# EasyEDA Pro project 舞台灯散热器适配(90W_灯珠驱动一体).epro

# Schematic 100W带驱动

## Sheets
1 P1: Board Name: KonkaH7Pro-90W灯板; Create Date: 2025-04-17; Page Name: P1; Project Name: 舞台灯散热器适配; Schematic Name: KonkaH7Pro; Update Date: 2025-04-17; Company: 嘉立创EDA; Page Size: A4; Version: V1.0
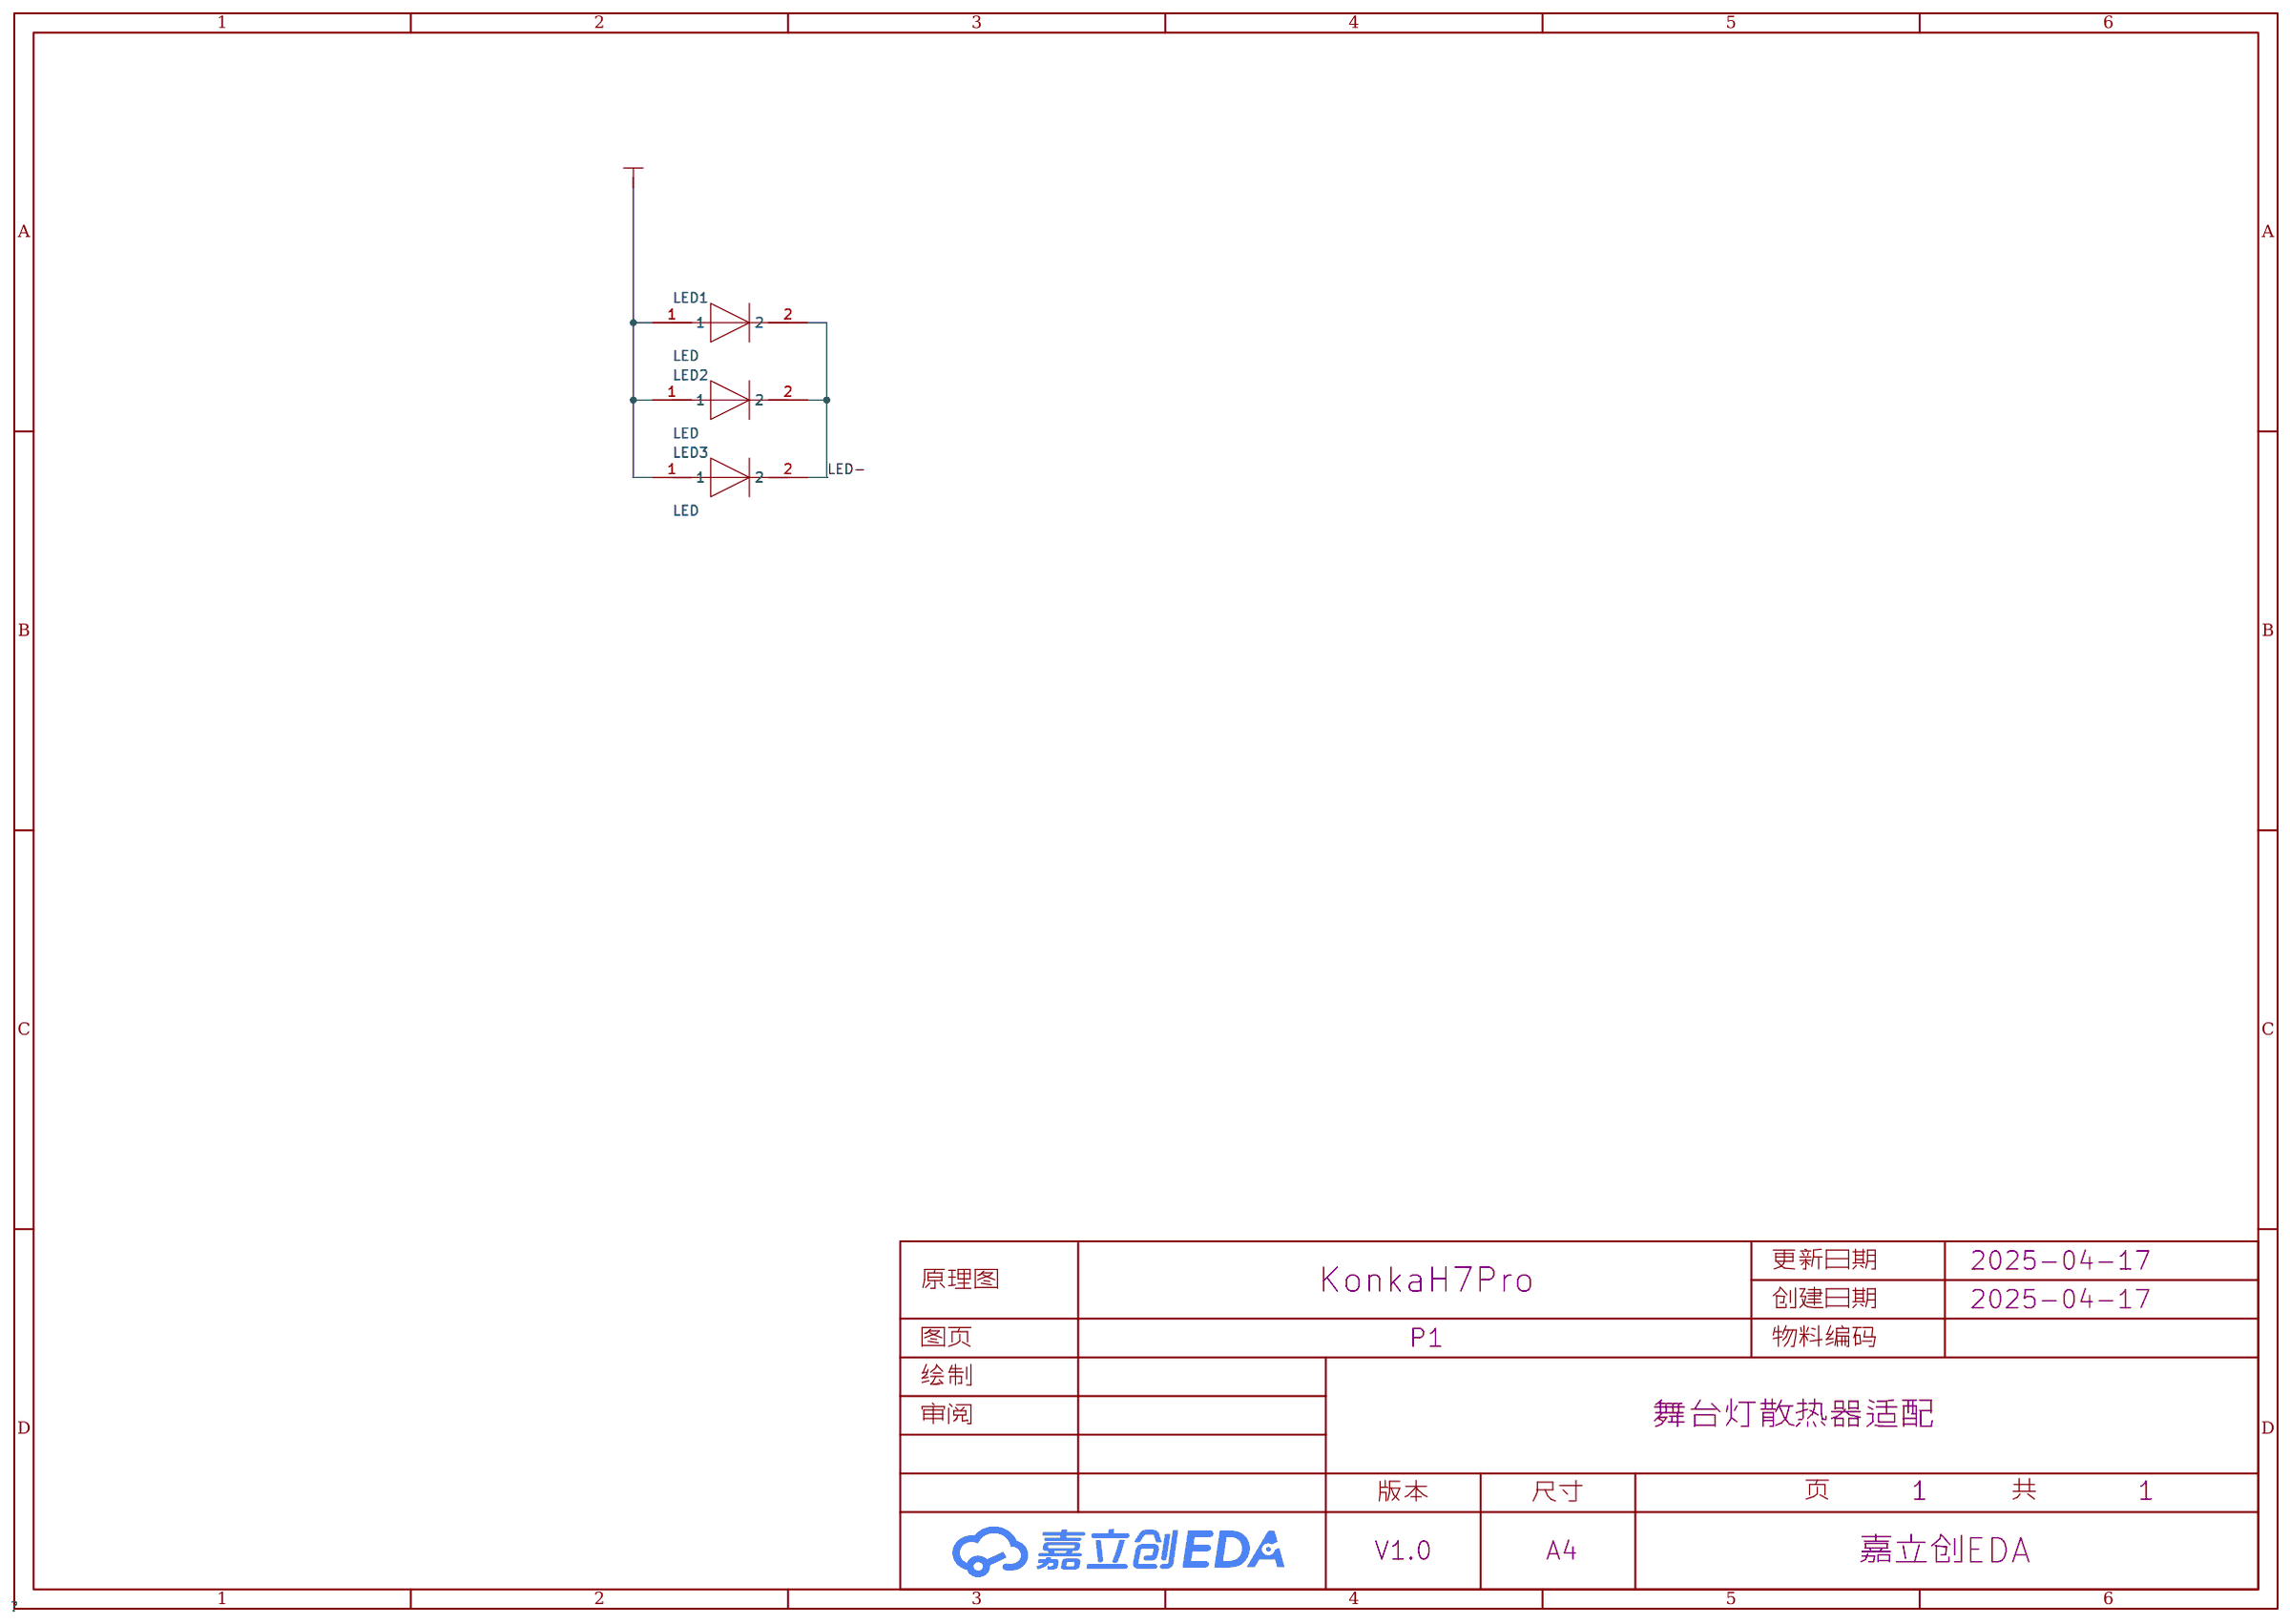
[diagram p0: P1]
2 P2: Board Name: 100W带驱动; Page Name: P2; Schematic Name: 100W带驱动
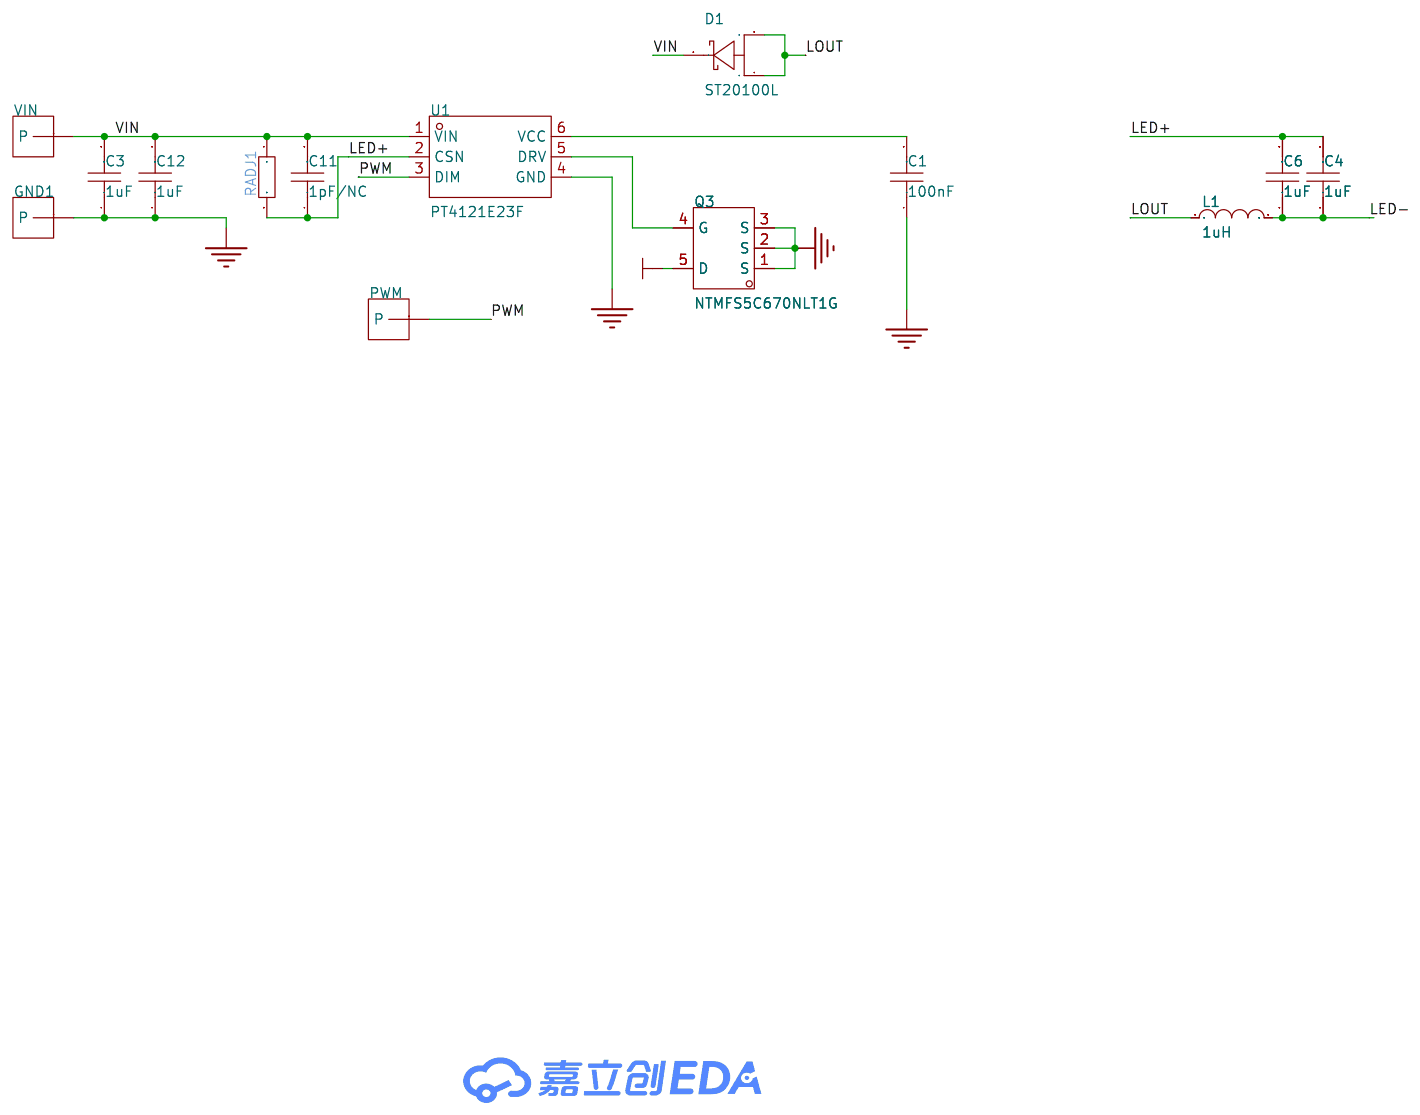
[diagram p1: P2]

## Parts
sheet P1
LED1  LED  [固仕泰3570LED-30W]
LED2  LED  [固仕泰3570LED-30W]
LED3  LED  [固仕泰3570LED-30W]
sheet P2
C1  100nF  [R0603]
C3  1uF  [C0805]
C4  1uF  [C0805]
C6  1uF  [C0805]
C11  1pF/NC  [R0603]
C12  1uF  [C0805]
D1  ST20100L  [TO-277_3P-L5.7-W4.2-LS6.5-BR]
GND1  -  [焊盘1.6*2.2mm]  (no BOM)
L1  1uH  [IND-SMD_L7.0-W6.6]
PWM  -  [焊盘1.6*2.2mm]  (no BOM)
Q3  NTMFS5C670NLT1G  [DFN-5_L6.1-W5.1-P1.27-BL]
RADJ1  20mΩ  [RES-SMD_L6.4-W3.2_LR2512D-3W-1MR]
U1  PT4121E23F  [SOT-23-6_L2.9-W1.6-P0.95-LS2.8-BR]
VIN  -  [焊盘1.6*2.2mm]  (no BOM)

## Library data of the parts
LED1-LED3 = 固仕泰3570LED-30W: 固仕泰3570-30WLED驱动电压9V，功率30W; Supplier: 深圳固仕泰
C1 C11 = CAP_0603: Supplier Footprint: 0603
C3 C4 C6 C12 = CL21B105KBFNNNE: 容值:1uF;精度:±10%;额定电压:50V;材质(温度系数):X7R;; LCSC Part Name: 1uF ±10% 50V; Supplier Part: C28323; Manufacturer: SAMSUNG(三星); Supplier Footprint: 0805; JLCPCB Part Class: Basic Part; Datasheet: https://atta.szlcsc.com/upload/public/pdf/source/20160218/1457707763339.pdf; Supplier: LCSC; Tolerance: ±10%; Voltage Rated: 50V; Temperature Coefficient: X7R
D1 = ST20100L: 二极管配置:独立式;正向压降(Vf):650mV@20A;直流反向耐压(Vr):100V;整流电流:20A;; LCSC Part Name: 电压:100V 电流:20A; Supplier Part: C2693410; Manufacturer: CJ(江苏长电/长晶); Supplier Footprint: TO-277; JLCPCB Part Class: 扩展库; Datasheet: https://atta.szlcsc.com/upload/public/pdf/source/20210330/C2693410_9551F5ED840A67394421895091158B3C.pdf; Supplier: LCSC; Diode Configuration: 独立式; Forward Voltage (Vf@If): 650mV@20A; Reverse Voltage (Vr): 100V; Rectified Current: 20A; Reverse Leakage Current (Ir): 30uA@100V
GND1 PWM VIN = 焊盘1.6x2.2: 焊盘：1.6mm*2.2mm
L1 = APH0630T1R0M: 电感值:1uH;精度:±20%;额定电流:10.73A;饱和电流(Isat):12.45A;类型:一体成型电感;; LCSC Part Name: 1uH ±20% 12.45A; Supplier Part: C5349700; Manufacturer: APV(爱普微); Supplier Footprint: SMD,7x6.6mm; JLCPCB Part Class: Extended Part; Datasheet: https://atta.szlcsc.com/upload/public/pdf/source/20240422/44C6AF90C0CE08E50D7C2708B16BB974.pdf; Supplier: LCSC; Tolerance: ±20%; Rated Current: 10.73A; Saturation Current (Isat): 12.45A; DC Resistance (DCR): 7.4mΩ; Type: 一体成型电感
Q3 = NTMFS5C670NLT1G: 类型:1个N沟道;漏源电压(Vdss):60V;连续漏极电流(Id):71A;导通电阻(RDS(on)@Vgs,Id):6.1mΩ@10V,35A;功率(Pd):61W;阈值电压(Vgs(th)@Id):2V@53uA;; LCSC Part Name: 1个N沟道 耐压:60V 电流:71A; Supplier Part: C179626; Manufacturer: onsemi(安森美); Supplier Footprint: DFN-5(5x6); JLCPCB Part Class: 扩展库; Datasheet: https://atta.szlcsc.com/upload/public/pdf/source/20221020/CBB579D21F9290D8F14D82B122325F26.pdf; Supplier: LCSC; Type: 1个N沟道; Drain Source Voltage (Vdss): 60V; Continuous Drain Current (Id): 71A; Drain Source On Resistance (RDS(on)@Vgs,Id): 6.1mΩ@10V,35A; Power Dissipation (Pd): 61W; Gate Threshold Voltage (Vgs(th)@Id): 2V@53uA; Total Gate Charge (Qg@Vgs): 20nC@10V; Input Capacitance (Ciss@Vds): 1.4nF@25V; Reverse Transfer Capacitance (Crss@Vds): 15pF@25V; Operating Temperature: -55℃~+175℃
RADJ1 = HoYLR2512-3W-20mR-1%: 电阻类型:采样电阻;阻值:20mΩ;精度:±1%;功率:3W;安装方式:贴片;; LCSC Part Name: 20mΩ ±1% 3W; Supplier Part: C5375467; Manufacturer: Milliohm(毫欧); Supplier Footprint: 2512; JLCPCB Part Class: Extended Part; Datasheet: https://atta.szlcsc.com/upload/public/pdf/source/20230410/281FB57F2A31C64FD07DBC5FCC932F0E.pdf; Supplier: LCSC; Type: 采样电阻; Tolerance: ±1%; Power(Watts): 3W; Mounting Sytle: 贴片
U1 = PT4121E23F: Supplier Part: C89775; Manufacturer: PowTech(华润矽威); Supplier Footprint: SOT-23-6; JLCPCB Part Class: 扩展库; Datasheet: https://atta.szlcsc.com/upload/public/pdf/source/20180326/C89775_D0E1014B7A1574597EA3FB2749903689.pdf; Supplier: LCSC

## Nets
GND: C1.1 C3.1 C12.1 GND1.1(P) Q3.1(S) Q3.2(S) Q3.3(S) U1.4(GND)
VIN: C3.2 C11.2 C12.2 D1.2(K) RADJ1.1 U1.1(VIN) VIN.1(P)
LED+: C4.2 C6.2 C11.1 LED1.1 LED2.1 LED3.1 RADJ1.2 U1.2(CSN)
LED-: C4.1 C6.1 L1.2 LED1.2 LED2.2 LED3.2
LOUT: D1.1(A) D1.3(A) L1.1 Q3.5(D)
PWM: PWM.1(P) U1.3(DIM)
$2N862: C1.2 U1.6(VCC)
$2N881: Q3.4(G) U1.5(DRV)

# Board 100W带驱动
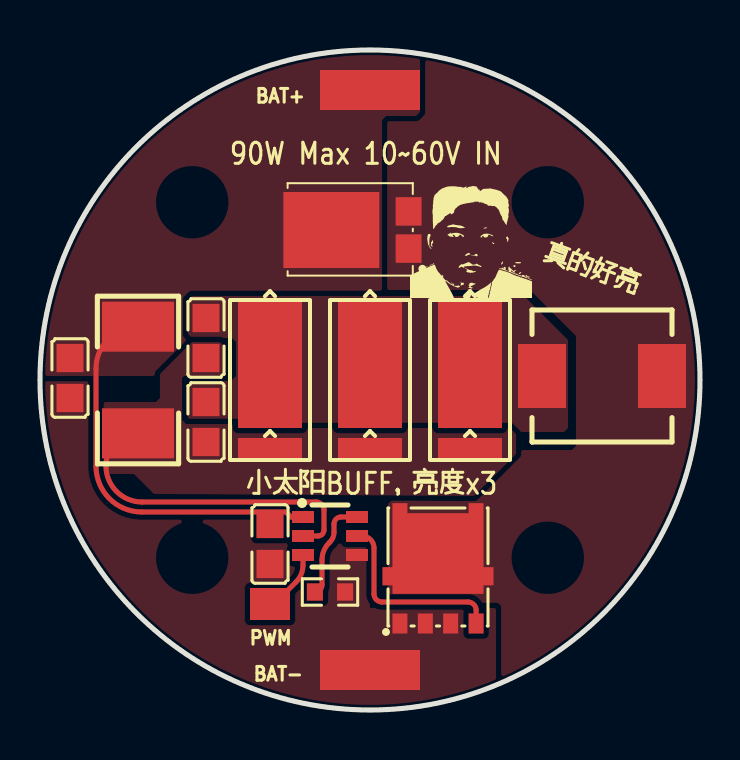
[diagram p2: board, top side]
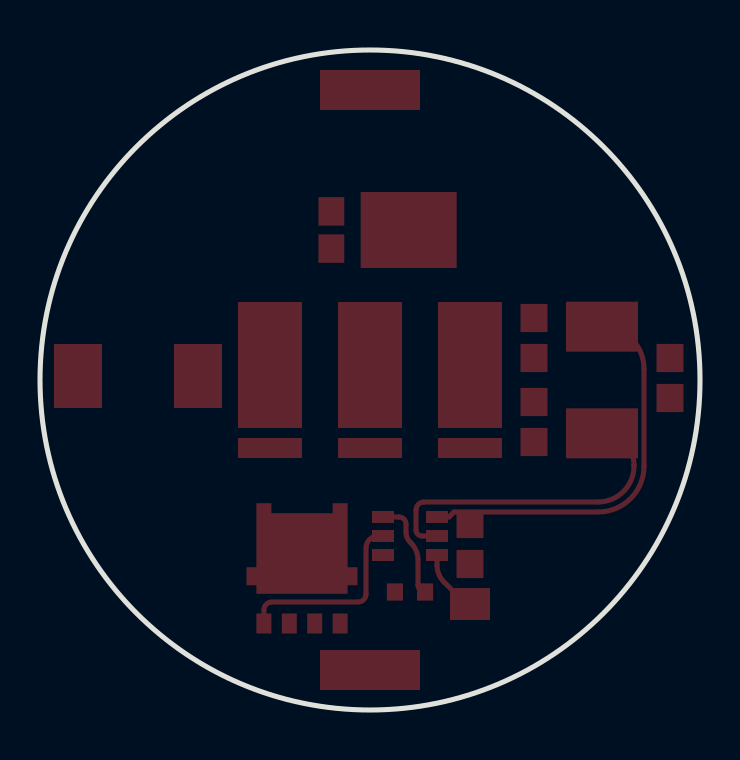
[diagram p3: board, bottom side, seen from below]

Outline 33 x 33 mm; copper layers: Top Layer, Bottom Layer. Coordinates in mm from the lower left corner of the outline.
Outline path: circle c16.5,16.5 r16.5
Stack: Top Layer 0.035mm - / Dielectric1 1.51mm FR4 er 4.5 / Bottom Layer 0.035mm -

## Design rules (mm)
net LED+: DP1
net VIN: DP1
template: 自定义配置
spacing copperThickness1oz (default): track to track 0.102, other pairs 0.152 to 0.3
spacing copperThickness2oz: track to track 0.203, other pairs 0.152 to 0.3
track width copperThickness1oz (default): min 0.127, default 0.254, max 2.54
track width copperThickness2oz: min 0.203, default 0.254, max 2.54
differential pair differentialPair (default): width min 0.127, default 0.254, max 2.54; gap min 0.152, default 0.152
via viaSize (default): diameter min 0.5, default 0.61, max 10; hole min 0.3, default 0.305, max 6.3

## Placement (name value [footprint] x y rotation side)
BAT+  -  [焊盘1.6*2.2mm#2]  15.7 29.9 0 top
BAT-  -  [焊盘1.6*2.2mm#2]  15.7 0.9 0 top
C1  100nF  [R0603]  14.5 5.9 180 top
C3  1uF  [C0805]  11.5 8.3 90 top
C4  1uF  [C0805]  8.3 18.6 270 top
C6  1uF  [C0805]  8.3 14.4 270 top
C12  1uF  [C0805]  1.5 16.6 90 top
D1  ST20100L  [TO-277_3P-L5.7-W4.2-LS6.5-BR]  16.5 24 0 top
L1  1uH  [IND-SMD_L7.0-W6.6]  28.1 16.7 180 top
LED1  LED  [固仕泰3570LED-30W]  11.5 16.5 90 top
LED2  LED  [固仕泰3570LED-30W]  16.5 16.5 90 top
LED3  LED  [固仕泰3570LED-30W]  21.5 16.5 90 top
PWM  -  [焊盘1.6*2.2mm]  10.4 6.1 270 top
Q3  NTMFS5C670NLT1G  [DFN-5_L6.1-W5.1-P1.27-BL]  19.9 6.2 0 top
RADJ1  20mΩ  [RES-SMD_L6.4-W3.2_LR2512D-3W-1MR]  4.9 16.5 270 top
U1  PT4121E23F  [SOT-23-6_L2.9-W1.6-P0.95-LS2.8-BR]  14.5 8.7 180 top

## Footprints (pads in the part's own frame, mm; a bottom-side part is the same pattern mirrored in y, then rotated)
C0805
  rect 1.41x1.35 smd: 1(-1,0) 2(1,0)
DFN-5_L6.1-W5.1-P1.27-BL
  rect 0.75x1 smd: 1(-1.905,-1.875) 2(-0.635,-1.875) 3(0.635,-1.875) 4(1.905,-1.875)
  custom 5.55x4.53 smd: 5(0,1.875)
IND-SMD_L7.0-W6.6
  rect 2.4x3.2 smd: 1(-3,0) 2(3,0)
R0603
  rect 0.806x0.864 smd: 1(-0.753,0) 2(0.753,0)
RES-SMD_L6.4-W3.2_LR2512D-3W-1MR
  rect 2.5x3.6 smd: 1(-2.667,0) 2(2.667,0)
SOT-23-6_L2.9-W1.6-P0.95-LS2.8-BR
  rect 1.1x0.6 smd: 1(1.35,-0.95) 2(1.35,0) 3(1.35,0.95) 4(-1.35,0.95) 5(-1.35,0) 6(-1.35,-0.95)
TO-277_3P-L5.7-W4.2-LS6.5-BR
  rect 1.29x1.423 smd: 1(1.933,-0.93) 3(1.933,0.93)
  rect 4.8x3.8 smd: 2(-1.933,0)
固仕泰3570LED-30W
  rect 1x3.2 smd: 1(-3.4,0)
  rect 6.3x3.2 smd: 2(0.75,0)
焊盘1.6*2.2mm
  rect 1.6x2 smd: 1(0.8,1.1)
焊盘1.6*2.2mm#2
  rect 5x2 smd: 1(0.8,1.1)

## Nets
GND: BAT-.1 C1.1 C3.1 C12.1 Q3.1 Q3.2 Q3.3 U1.4
VIN: BAT+.1 C3.2 C12.2 D1.2 RADJ1.1 U1.1
LED+: C4.2 C6.2 LED1.1 LED2.1 LED3.1 RADJ1.2 U1.2
LED-: C4.1 C6.1 L1.2 LED1.2 LED2.2 LED3.2
LOUT: D1.1 D1.3 L1.1 Q3.5
PWM: PWM.1 U1.3
$2N862: C1.2 U1.6
$2N881: Q3.4 U1.5

## Routing (per net, layer and track width the routed paths; a pad name or vN(x,y) marks a point on that pad's centre or on a via; arc(x,y) is an arc through that point)
VIN: length 19.9
  Top Layer w0.254: U1.1 12.55,9.65 12.3,9.9 5.09,9.9 arc(3.47,10.57) 2.8,12.19 2.8,17.07 arc(3.42,18.55) RADJ1.1
LED+: length 16.9
  Top Layer w0.254: U1.2 13.9,8.7 arc(14.11,8.79) 14.2,9 14.2,10 arc(14.08,10.28) 13.8,10.4 5.1,10.4 arc(3.83,10.93) 3.3,12.2 3.3,12.23 arc(3.77,13.36) RADJ1.2
PWM: length 3.2
  Top Layer w0.254: U1.3 13.15,7.25 arc(13.06,6.79) 12.8,6.4 11.84,5.44 arc(11.68,5.34) PWM.1
$2N862: length 5.1
  Top Layer w0.254: U1.6 15.05,9.65 arc(14.8,9.55) 14.7,9.3 14.7,8.88 arc(14.65,8.62) 14.5,8.4 14.45,8.35 arc(14.19,7.96) 14.1,7.5 14.1,6.25 arc(14,6) C1.2
$2N881: length 9.7
  Top Layer w0.254: Q3.4 21.81,5 arc(21.69,5.28) 21.4,5.4 17.1,5.4 arc(16.82,5.52) 16.7,5.8 16.7,8.1 arc(16.52,8.52) 16.1,8.7 U1.5

## Copper pours and planes (outline as drawn; the poured copper is in the pictures)
GND on Top Layer: 16.5,16.5 16.5,5.1 22.8,5.1 22.8,-1.1 -1.2,-1.1 -1.2,16.5
VIN on Top Layer: 17.3,29.7 17.1,29.5 17.1,20.2 16.9,20 9.7,20 9.5,19.8 9.5,16.9 9.3,16.7 -3.1,16.7 -3.1,34.3 19,34.3 19,29.9 18.8,29.7
LED+ on Top Layer: 3.2,15.4 5.8,15.4 6,15.6 6,16.8 7.6,18.4 9,18.4 9.2,18.2 9.2,16.9 9,16.7 7.2,16.7 7.1,16.6 7.1,14.5 7.3,14.3 9.8,14.3 10,14.1 23.5,14.1 23.8,13.8 23.8,12.8 21.7,10.7 5.69,10.81 4.7,11.8 3.5,11.8 3,12.3 3,15.2
LED- on Top Layer: 7.6,16.45 9.55,16.45 9.8,16.7 9.8,18.4 9.6,18.6 7.6,18.6 7.4,18.8 7.4,20.5 7.6,20.7 24.2,20.7 26.4,18.5 26.4,14.1 26.2,13.9 10,13.9 9.55,14.35 7.6,14.35 7.4,14.55 7.4,16.25
LOUT on Top Layer: 34.9,12.7 33.6,12.7 33.6,-1.1 22.4,-1.1 22.4,4.8 21.6,5.6 17.6,5.6 17.4,5.8 17.4,10.3 17.6,10.5 21.7,10.5 23.7,12.5 23.7,12.8 23.9,13 26.6,13 26.8,13.2 26.8,18.7 24.5,21 17.3,21 17.3,34.5 33.8,34.5 33.8,21 34.9,21

## Text on the board
Top Solder Mask Layer: Urmouky Designed | 250417 V0.1
Top Silkscreen Layer: 90W Max 10~60V IN | 真的好亮 | 小太阳BUFF，亮度x3
